# Altium project BMS_PCB.PrjPcb (part 3 of 3)

## Sheet Miccrocontroller.SchDoc
size 1244 x 774 mm; SheetNumber: 2; SheetTotal: 2
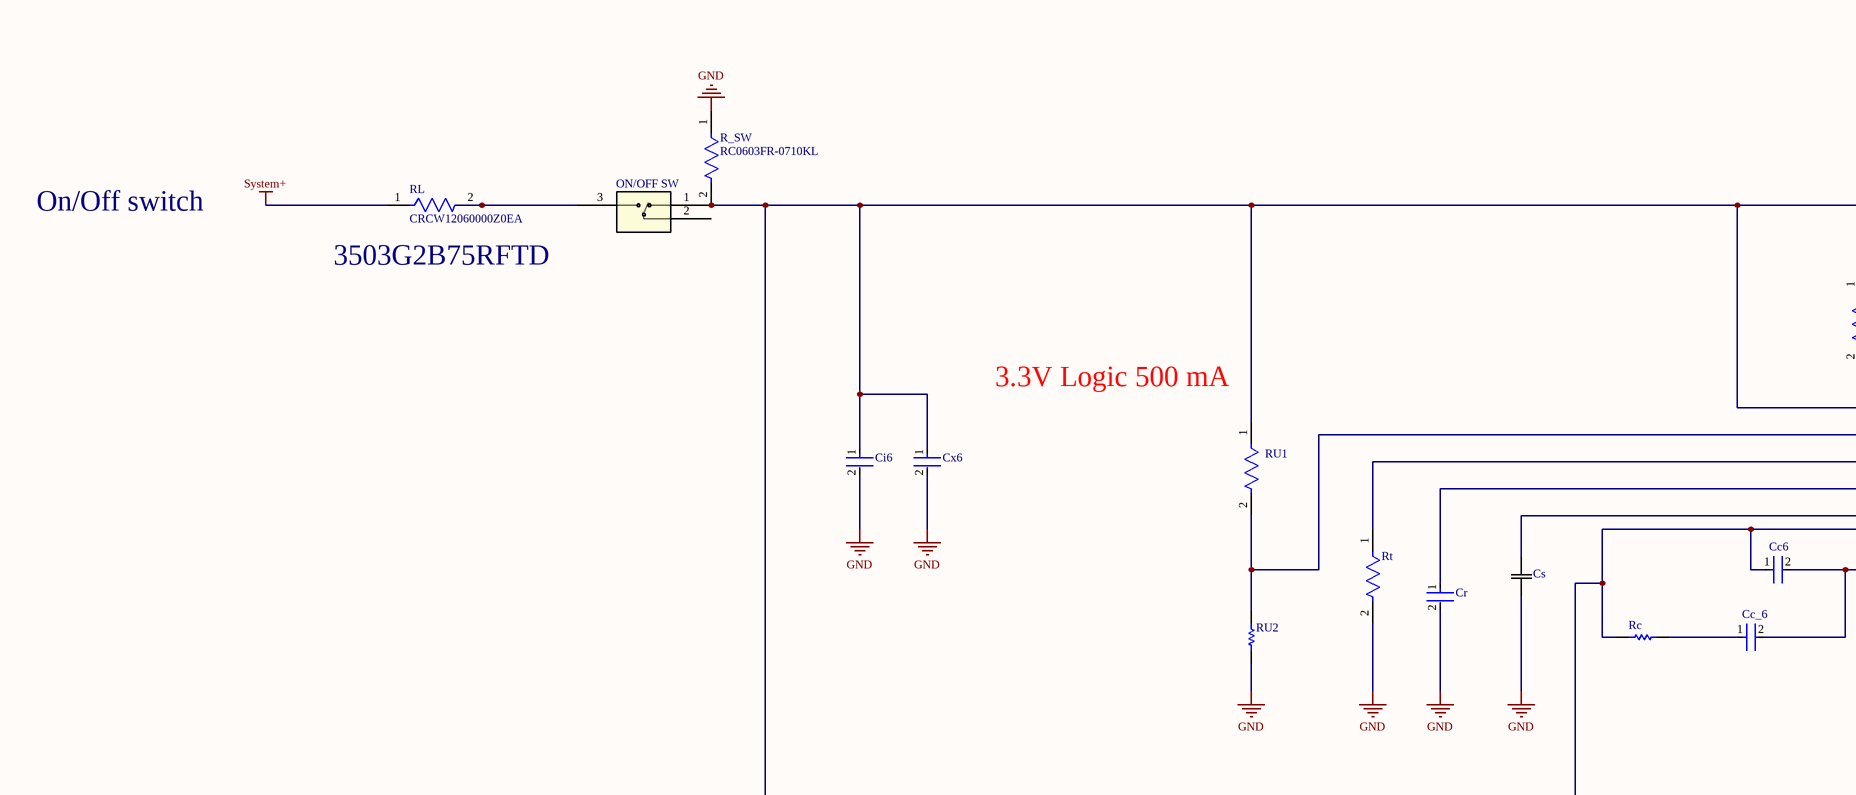
[diagram p8: Miccrocontroller.SchDoc, top left]
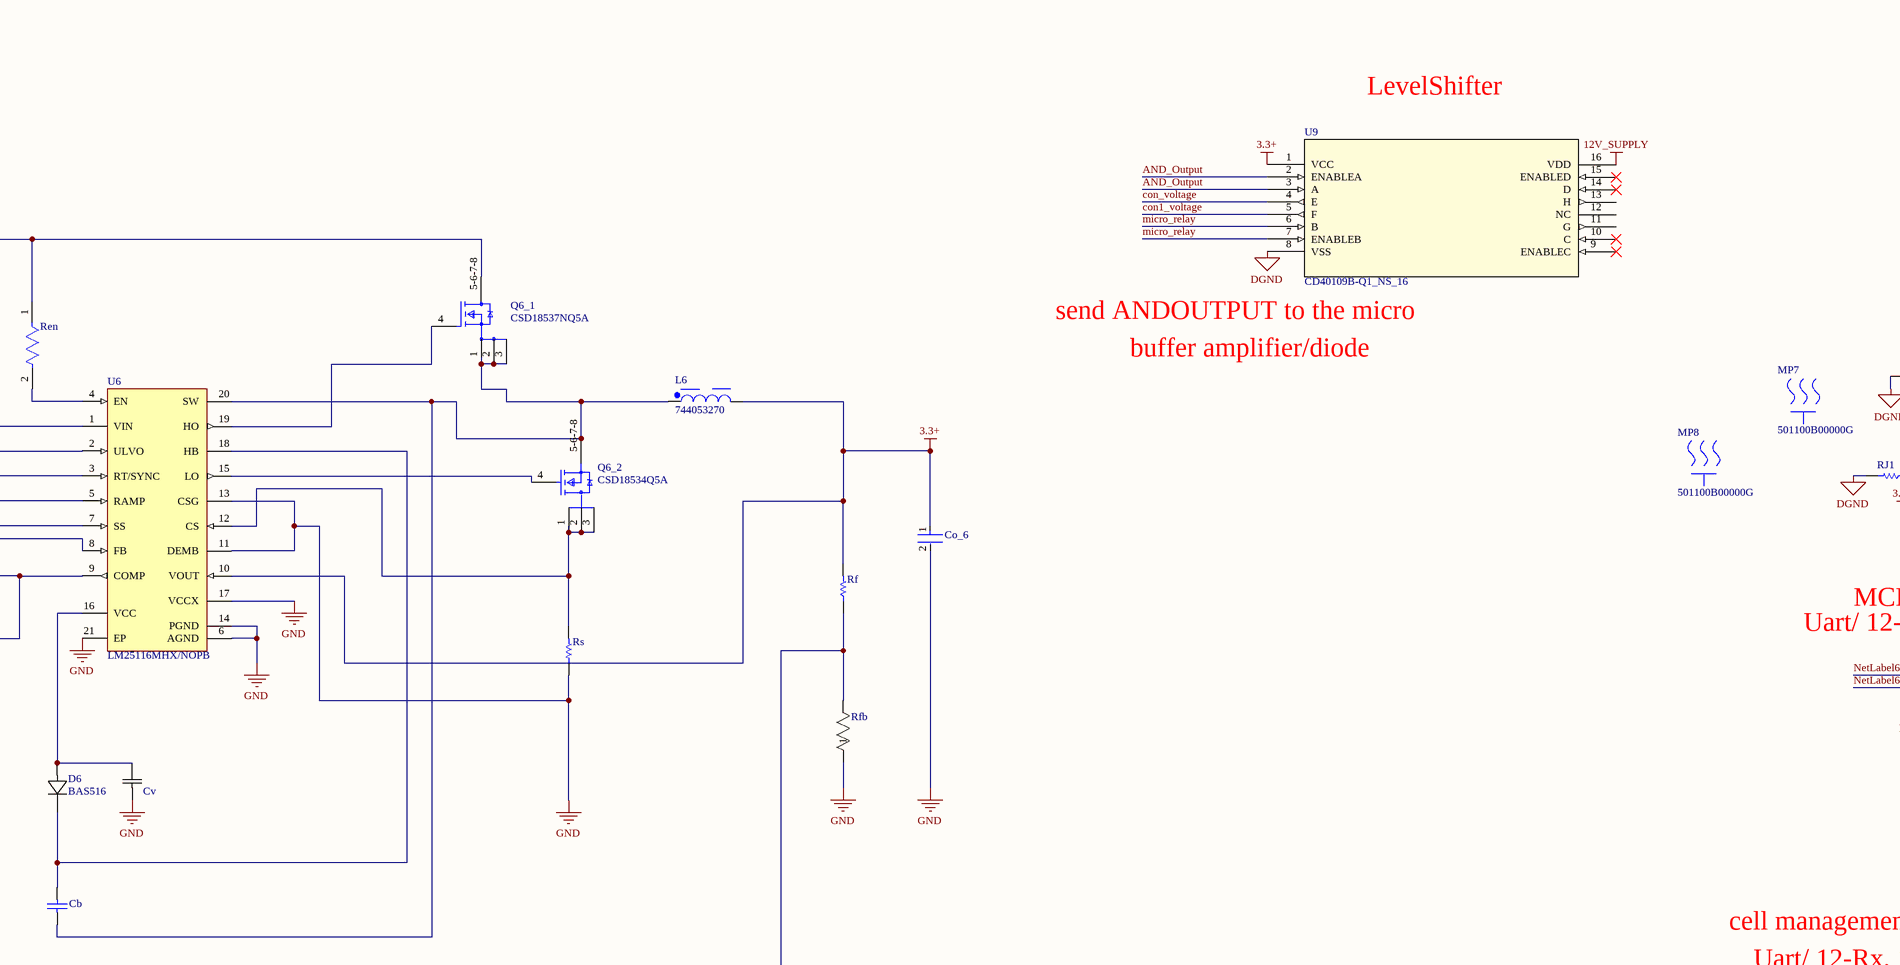
[diagram p9: Miccrocontroller.SchDoc, top middle]
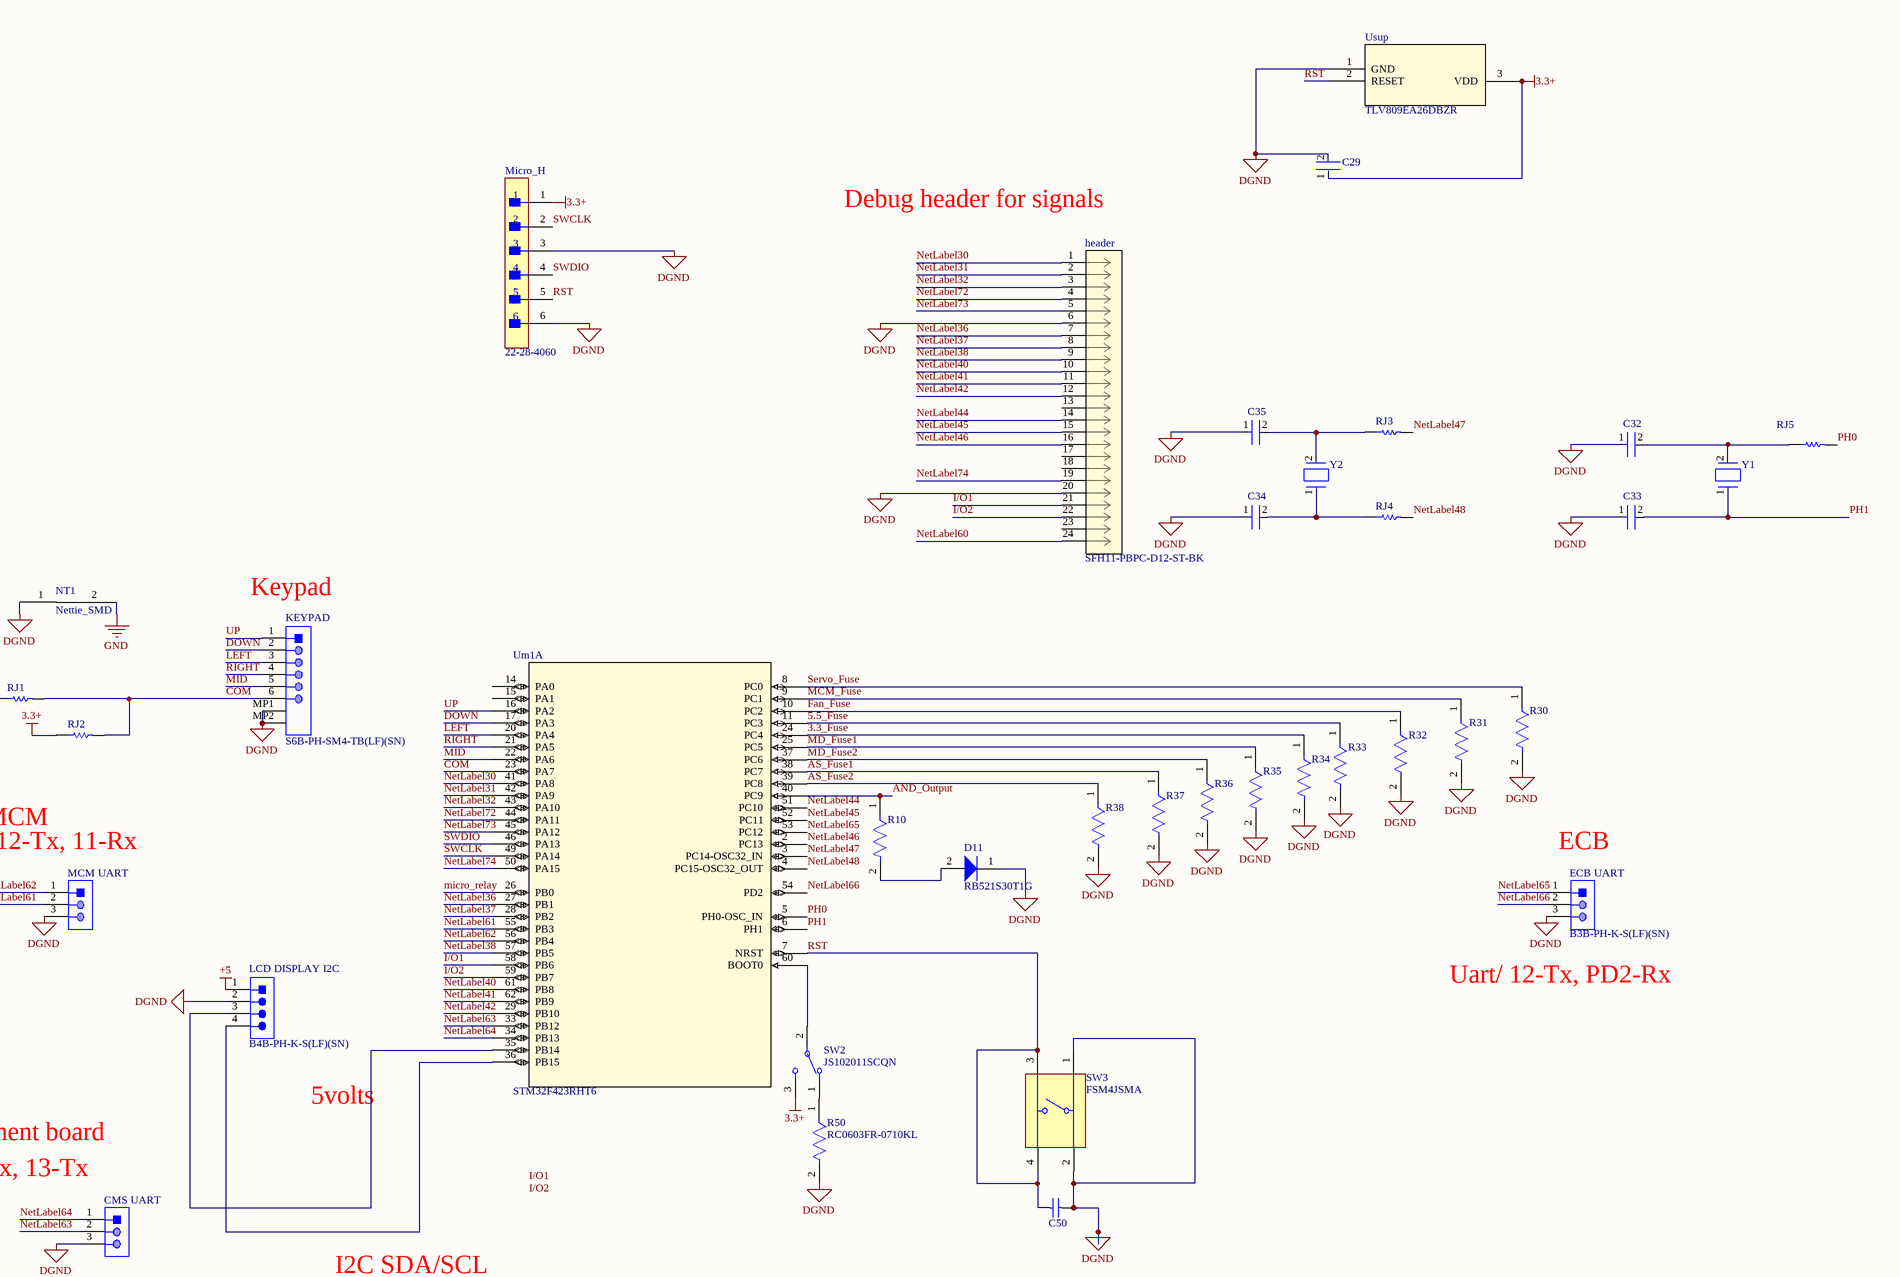
[diagram p10: Miccrocontroller.SchDoc, top right]
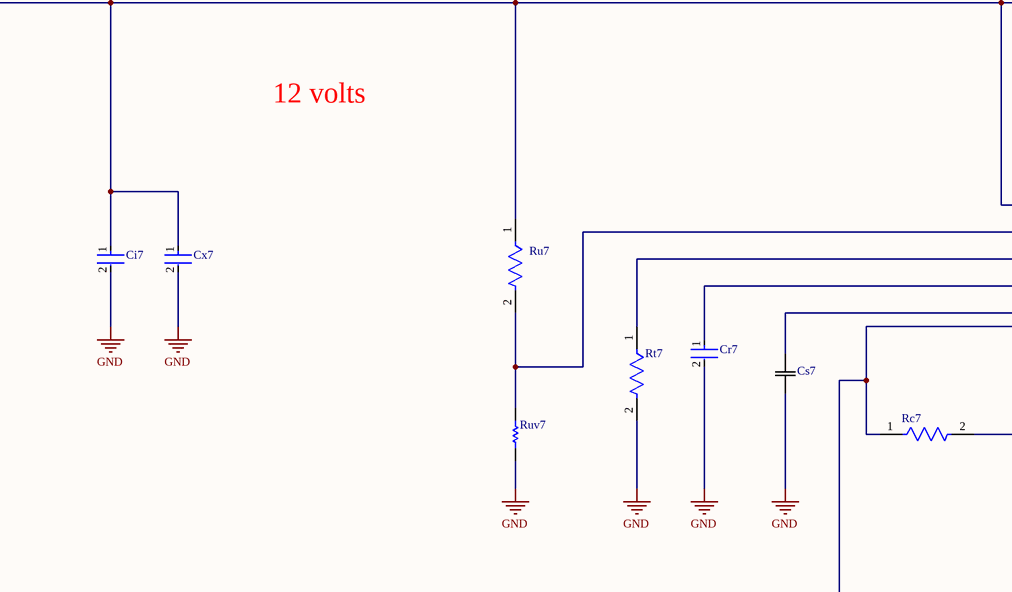
[diagram p11: Miccrocontroller.SchDoc, bottom left]
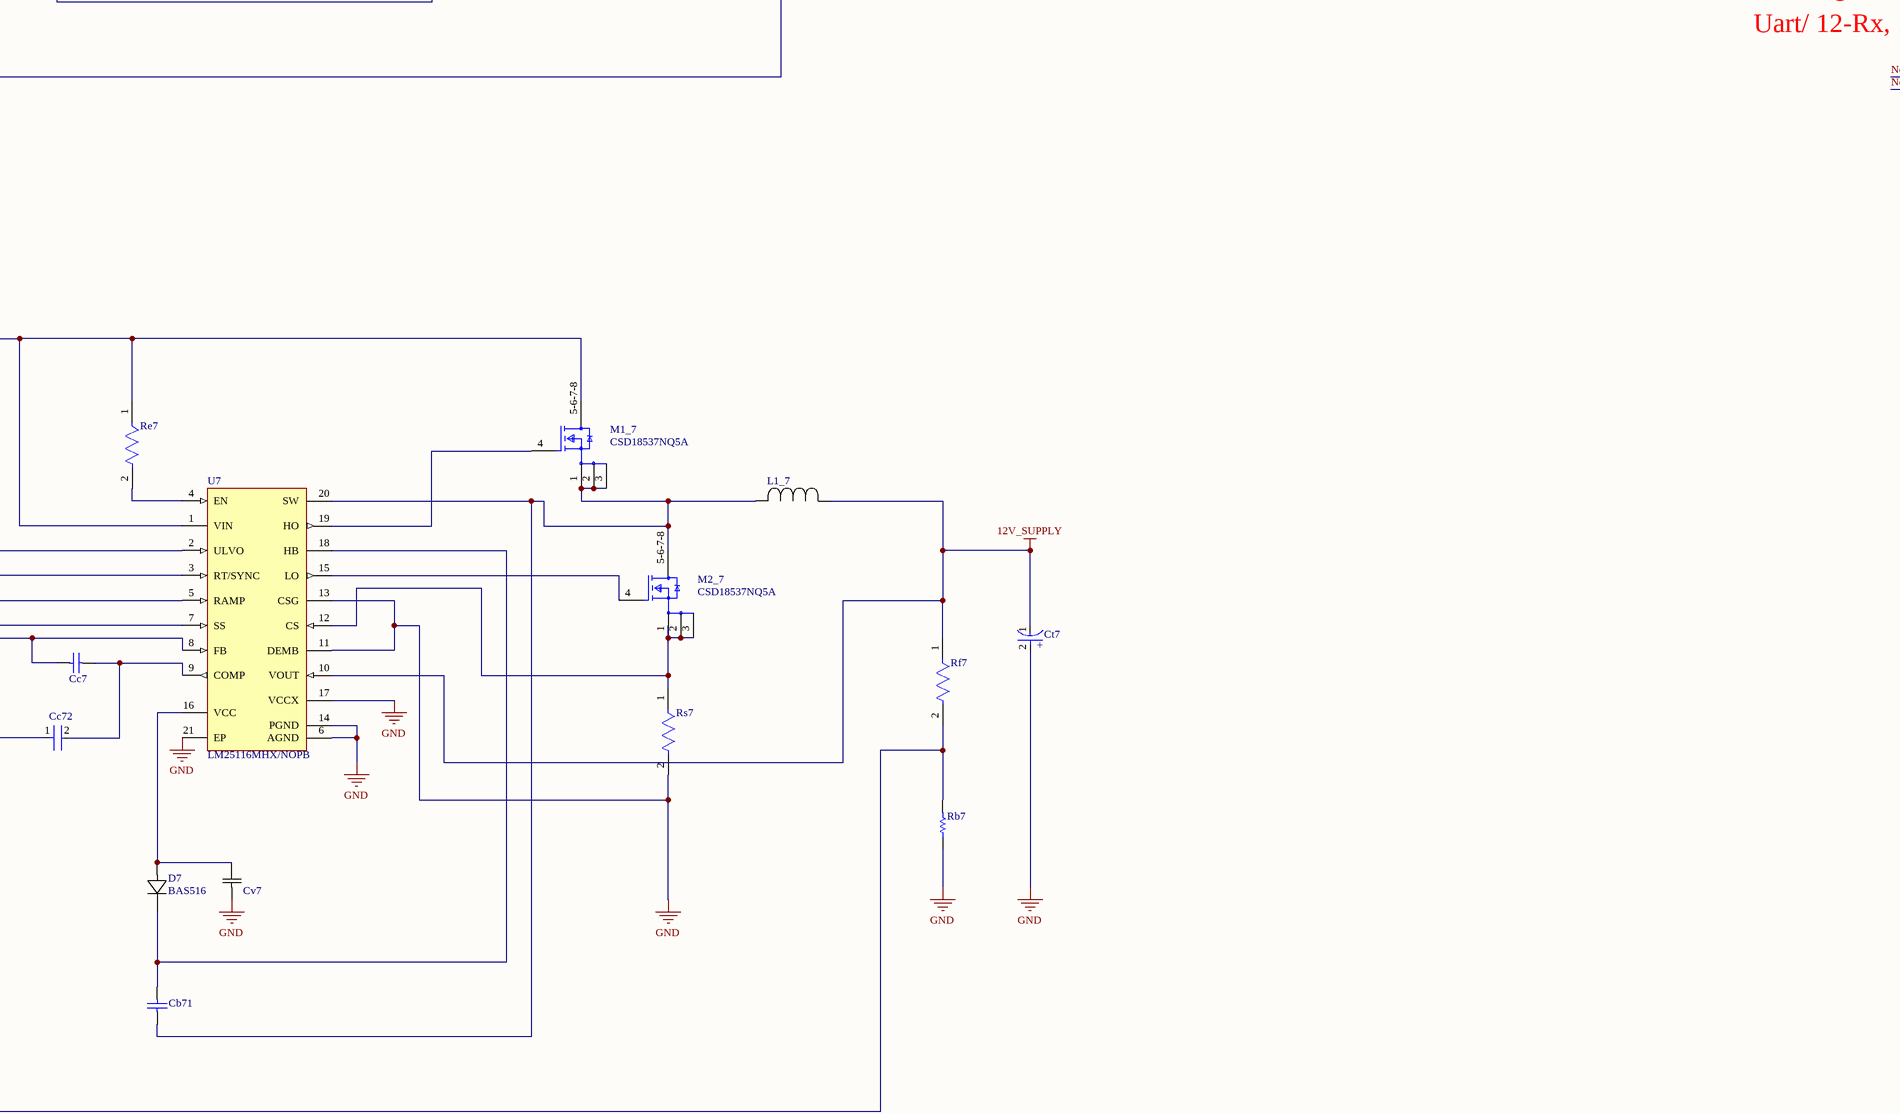
[diagram p12: Miccrocontroller.SchDoc, bottom middle]
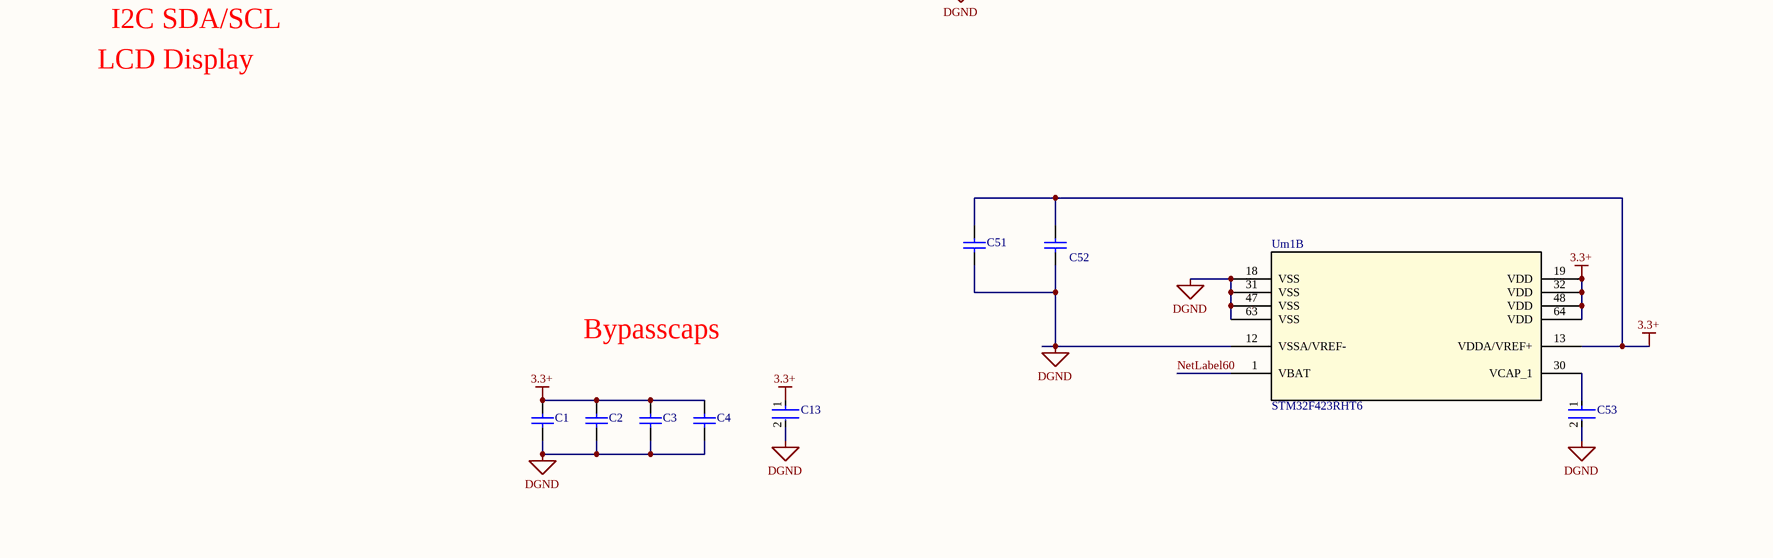
[diagram p13: Miccrocontroller.SchDoc, bottom right]

### Parts
C1  06035C104KAT4A  [CAPC1608X90X35LL15T15]  (value not drawn)
C2  06035C104KAT4A  [CAPC1608X90X35LL15T15]  (value not drawn)
C3  06035C104KAT4A  [CAPC1608X90X35LL15T15]  (value not drawn)
C4  06035C104KAT4A  [CAPC1608X90X35LL15T15]  (value not drawn)
C13  GRM188R61E475KE11D  [FP-GRM188-0_15-IPC_C]  (value not drawn)
C29  GRM155R71C104KA88D  [FP-GRM15-MFG]  (value not drawn)
C32  C0805C180J5GACTU  [FP-C0805C-DN-MFG]  (value not drawn)
C33  C0805C180J5GACTU  [FP-C0805C-DN-MFG]  (value not drawn)
C34  GJM1555C1H1R5BB01D  [FP-GJM155-0_05-IPC_C]  (value not drawn)
C35  GJM1555C1H1R5BB01D  [FP-GJM155-0_05-IPC_C]  (value not drawn)
C50  06035C104KAT4A  [CAPC1608X90X35LL15T15]  (value not drawn)
C51  C0603C105K3RACTU  [CAPC1608X87X35LL15T15]  (value not drawn)
C52  06035C104KAT4A  [CAPC1608X90X35LL15T15]  (value not drawn)
C53  GRM188R71A225KE15D  [FP-GRM188-0_1-e0_2_0_5-MFG]  (value not drawn)
Cb  08053C104K4T2A  [CAPC2013X140X50LL20T25]  (value not drawn)
Cb71  08053C104K4T2A  [CAPC2013X140X50LL20T25]  (value not drawn)
Cc6  C0805C100M4GACTU  [FP-C0805C-DN-MFG]  (value not drawn)
Cc7  GRM1555C1E5R1CA01D  [CAPC1005X55X25LL05T10]  (value not drawn)
Cc72  GRM1555C1H101FA01D  [FP-GRM155-0_05-IPC_C]  (value not drawn)
Cc_6  UMK105CG271JV-F  [FP-0402-L_1_0_0_05-W_0_5-IPC_B]  (value not drawn)
Ci6  GRM31CR71H475KA12L  [FP-GRM31C-0_2-e0_3_0_8-IPC_C]  (value not drawn)
Ci7  GRM31CR71H475KA12L  [FP-GRM31C-0_2-e0_3_0_8-IPC_C]  (value not drawn)
CMS_UART  B3B-PH-K-S(LF)(SN)  [JST-B3B-PH-K-S-3_V]  (value not drawn)
Co_6  C0805C475K8PACTU  [FP-C0805C475K8PACTU-MFG]  (value not drawn)
Cr  GRM1555C1H101FA01D  [FP-GRM155-0_05-IPC_C]  (value not drawn)
Cr7  UMK105CG271JV-F  [FP-0402-L_1_0_0_05-W_0_5-IPC_B]  (value not drawn)
Cs  CGA4J2C0G1H333J125AA  [CAP_2012_TDK-M]  (value not drawn)
Cs7  CGA4J2C0G1H333J125AA  [CAP_2012_TDK-M]  (value not drawn)
Ct7  25SVPF27MX  [FP-OS-CON-SMT-B6-MFG]  (value not drawn)
Cv  TMK212BJ105KG-T  [CAP_TMK212BJ105KG-T_TAY]  (value not drawn)
Cv7  TMK212BJ105KG-T  [CAP_TMK212BJ105KG-T_TAY]  (value not drawn)
Cx6  C0805C104M5RACTU  [FP-C0805C-DN-MFG]  (value not drawn)
Cx7  C0805C104M5RACTU  [FP-C0805C-DN-MFG]  (value not drawn)
D6  BAS516  [SOD523_NEX]
D7  BAS516  [SOD523_NEX]
D11  RB521S30T1G  [ONSC-SOD-523-2-502-01_V]
ECB_UART  B3B-PH-K-S(LF)(SN)  [JST-B3B-PH-K-S-3_V]
header  SFH11-PBPC-D12-ST-BK  [CONN_SFH11-PBPC-D12-ST-BK]
KEYPAD  S6B-PH-SM4-TB(LF)(SN)  [JST-S6B-PH-SM4-TB(LF)(SN)_V]
L1_7  MSS1038-123MLB  [IND_MSS1038_COC]  (value not drawn)
L6  744053270  [WE-TPC_5828]
LCD_DISPLAY_I2C  B4B-PH-K-S(LF)(SN)  [JST-B4B-PH-K-S_V]
M1_7  CSD18537NQ5A  [FP-DQJ0008A-MFG]
M2_7  CSD18537NQ5A  [FP-DQJ0008A-MFG]
MCM_UART  B3B-PH-K-S(LF)(SN)  [JST-B3B-PH-K-S-3_V]  (value not drawn)
Micro_H  22-28-4060  [FP-22-28-4060-MFG]
MP7  501100B00000G  [FP-501100B00000G-MFG]
MP8  501100B00000G  [FP-501100B00000G-MFG]
NT1  Nettie_SMD  [Nettie_SMD]  (net tie, no BOM)
ON/OFF_SW  100SP1T1B4M2QE  [100SP1T1_EWI]  (value not drawn)
Q6_1  CSD18537NQ5A  [FP-DQJ0008A-MFG]
Q6_2  CSD18534Q5A  [FP-DQJ0008A-MFG]
R10  RC0603FR-0710KL  [FP-RC0603-0_55-IPC_C]  (value not drawn)
R30  RC0603FR-0710KL  [FP-RC0603-0_55-IPC_C]  (value not drawn)
R31  RC0603FR-0710KL  [FP-RC0603-0_55-IPC_C]  (value not drawn)
R32  RC0603FR-0710KL  [FP-RC0603-0_55-IPC_C]  (value not drawn)
R33  RC0603FR-0710KL  [FP-RC0603-0_55-IPC_C]  (value not drawn)
R34  RC0603FR-0710KL  [FP-RC0603-0_55-IPC_C]  (value not drawn)
R35  RC0603FR-0710KL  [FP-RC0603-0_55-IPC_C]  (value not drawn)
R36  RC0603FR-0710KL  [FP-RC0603-0_55-IPC_C]  (value not drawn)
R37  RC0603FR-0710KL  [FP-RC0603-0_55-IPC_C]  (value not drawn)
R38  RC0603FR-0710KL  [FP-RC0603-0_55-IPC_C]  (value not drawn)
R50  RC0603FR-0710KL  [FP-RC0603-0_55-IPC_C]
R_SW  RC0603FR-0710KL  [FP-RC0603-0_55-IPC_C]
Rb7  ERJ-6ENF9761V  [RESC2013X70X40ML20T20]  (value not drawn)
Rc  RC0402FR-0768K1L  [RESC1005X40X25NL05T10]  (value not drawn)
Rc7  CRCW0402191KFKED  [FP-CRCW0402-e3-IPC_C]  (value not drawn)
Re7  CRCW04021M00FKED  [FP-CRCW0402-e3-MFG]  (value not drawn)
Ren  CRCW04021M00FKED  [FP-CRCW0402-e3-MFG]  (value not drawn)
Rf  ERJ-6ENF1872V  [RESC2013X70X40LL20T20]  (value not drawn)
Rf7  AC0402FR-0786K6L  [FP-AC0402-IPC_B]  (value not drawn)
Rfb  RNCF0805BTE10K4  [RES_RNCF0805_STP]  (value not drawn)
RJ1  CRCW08050000Z0EA  [RESC2013X50X30LL20T20]  (value not drawn)
RJ2  CRCW08050000Z0EA  [RESC2013X50X30LL20T20]  (value not drawn)
RJ3  CRCW08050000Z0EA  [RESC2013X50X30LL20T20]  (value not drawn)
RJ4  CRCW08050000Z0EA  [RESC2013X50X30LL20T20]  (value not drawn)
RJ5  CRCW08050000Z0EA  [RESC2013X50X30LL20T20]  (value not drawn)
RL  CRCW12060000Z0EA  [FP-CRCW1206-e3-IPC_C]
Rs  ERJ-3RSFR15V  [RESC1608X55X30ML15T15]  (value not drawn)
Rs7  CSR1206FK15L0  [FP-CSR1206-IPC_B]  (value not drawn)
Rt  CRCW04025K23FKED  [FP-CRCW0402-e3-IPC_C]  (value not drawn)
Rt7  CRCW04025K23FKED  [FP-CRCW0402-e3-IPC_C]  (value not drawn)
RU1  CRCW080541K2FKEA  [Vishay_CRCW0805-e3_MFG]  (value not drawn)
RU2  ERJ-6ENF2491V  [RESC2013X70X40LL20T20]  (value not drawn)
Ru7  CRCW080541K2FKEA  [Vishay_CRCW0805-e3_MFG]  (value not drawn)
Ruv7  ERJ-6ENF2491V  [RESC2013X70X40LL20T20]  (value not drawn)
SW2  JS102011SCQN  [FP-JS102011SCQN-MFG]
SW3  FSM4JSMA  [TECO-FSM4JSMA_V]
U6  LM25116MHX/NOPB  [PWP0020A_N]
U7  LM25116MHX/NOPB  [PWP0020A_N]
U9  CD40109B-Q1_NS_16  [NS16_TEX]
Um1  STM32F423RHT6  [LQFP64-10x10mm]  (parts A,B of 2)
Usup  TLV809EA26DBZR  [SOT_26DBZR_TEX-M]
Y1  ABM7-25.000MHZ-D2Y-T  [FP-ABM7-MFG]  (value not drawn)
Y2  MU00525-32.768K  [FP-NX3215SA-MFG]  (value not drawn)

### Nets
3.3+: C1.2 C2.2 C3.2 C4.2 C13.1 C29.1 C51.2 C52.1 Co_6.1 L6.2 Micro_H.1 Rf.2 RJ2.1 SW2.3 U6.10(VOUT) U9.1(VCC) Um1.13(VDDA/VREF+) Um1.19(VDD) Um1.32(VDD) Um1.48(VDD) Um1.64(VDD) Usup.3(VDD)
12V_SUPPLY: Ct7.1(C) L1_7.1 Rf7.1 U7.10(VOUT) U9.16(VDD)
+5: LCD_DISPLAY_I2C.1
DGND: C1.1 C2.1 C3.1 C4.1 C13.2 C29.2 C32.1 C33.1 C34.1 C35.1 C50.1 C51.1 C52.2 C53.2 CMS_UART.3 D11.1(K) ECB_UART.3 header.6 header.20 KEYPAD.MP1 KEYPAD.MP2 LCD_DISPLAY_I2C.2 MCM_UART.3 Micro_H.3 Micro_H.6 NT1.1 R30.2 R31.2 R32.2 R33.2 R34.2 R35.2 R36.2 R37.2 R38.2 R50.2 RJ1.1 SW3.1 SW3.2 U9.8(VSS) Um1.12(VSSA/VREF-) Um1.18(VSS) Um1.31(VSS) Um1.47(VSS) Um1.63(VSS) Usup.1(GND)
GND: Ci6.2 Ci7.2 Co_6.2 Cr.2 Cr7.2 Cs.1 Cs7.1 Ct7.2(A) Cv.1 Cv7.1 Cx6.2 Cx7.2 NT1.2 R_SW.1 Rb7.1 Rfb.1 Rs.1 Rs7.2 Rt.2 Rt7.2 RU2.1 Ruv7.1 U6.6(AGND) U6.11(DEMB) U6.13(CSG) U6.14(PGND) U6.17(VCCX) U6.21(EP) U7.6(AGND) U7.11(DEMB) U7.13(CSG) U7.14(PGND) U7.17(VCCX) U7.21(EP)
System+: RL.1
3.3_Fuse: R34.1 Um1.24(PC4)
5.5_Fuse: R33.1 Um1.11(PC3)
AND_Output: R10.1 U9.2(ENABLEA) U9.3(A) Um1.40(PC9)
AS_Fuse1: R37.1 Um1.38(PC7)
AS_Fuse2: R38.1 Um1.39(PC8)
COM: KEYPAD.6 RJ1.2 RJ2.2 Um1.23(PA7)
con1_voltage: U9.5(F)
con_voltage: U9.4(E)
DOWN: KEYPAD.2 Um1.17(PA3)
Fan_Fuse: R32.1 Um1.10(PC2)
I/O1: header.21 Um1.58(PB6)
I/O2: header.22 Um1.59(PB7)
LEFT: KEYPAD.3 Um1.20(PA4)
MCM_Fuse: R31.1 Um1.9(PC1)
MD_Fuse1: R35.1 Um1.25(PC5)
MD_Fuse2: R36.1 Um1.37(PC6)
micro_relay: U9.6(B) U9.7(ENABLEB) Um1.26(PB0)
MID: KEYPAD.5 Um1.22(PA6)
NetLabel30: header.1 Um1.41(PA8)
NetLabel31: header.2 Um1.42(PA9)
NetLabel32: header.3 Um1.43(PA10)
NetLabel36: header.7 Um1.27(PB1)
NetLabel37: header.8 Um1.28(PB2)
NetLabel38: header.9 Um1.57(PB5)
NetLabel40: header.10 Um1.61(PB8)
NetLabel41: header.11 Um1.62(PB9)
NetLabel42: header.12 Um1.29(PB10)
NetLabel44: header.14 Um1.51(PC10)
NetLabel45: header.15 Um1.52(PC11)
NetLabel46: header.16 Um1.2(PC13)
NetLabel47: RJ3.2 Um1.3(PC14-OSC32_IN)
NetLabel48: RJ4.2 Um1.4(PC15-OSC32_OUT)
NetLabel60: header.24 Um1.1(VBAT)
NetLabel61: MCM_UART.2 Um1.55(PB3)
NetLabel62: MCM_UART.1 Um1.56(PB4)
NetLabel63: CMS_UART.2 Um1.33(PB12)
NetLabel64: CMS_UART.1 Um1.34(PB13)
NetLabel65: ECB_UART.1 Um1.53(PC12)
NetLabel66: ECB_UART.2 Um1.54(PD2)
NetLabel72: header.4 Um1.44(PA11)
NetLabel73: header.5 Um1.45(PA12)
NetLabel74: header.19 Um1.50(PA15)
PH0: RJ5.2 Um1.5(PH0-OSC_IN)
PH1: C33.2 Um1.6(PH1) Y1.1
RIGHT: KEYPAD.4 Um1.21(PA5)
RST: C50.2 Micro_H.5 SW3.3 SW3.4 Um1.7(NRST) Usup.2(RESET)
Servo_Fuse: R30.1 Um1.8(PC0)
SWCLK: Micro_H.2 Um1.49(PA14)
SWDIO: Micro_H.4 Um1.46(PA13)
UP: KEYPAD.1 Um1.16(PA2)
NetC32_2: C32.2 RJ5.1 Y1.2
NetC34_2: C34.2 RJ4.1 Y2.1
NetC35_2: C35.2 RJ3.1 Y2.2
NetC53_1: C53.1 Um1.30(VCAP_1)
NetCb71_1: Cb71.1 L1_7.2 M1_7.1(S) M1_7.2(S) M1_7.3(S) M2_7.5-6-7-8(D) U7.20(SW)
NetCb71_2: Cb71.2 D7.1 U7.18(HB)
NetCb_1: Cb.1 L6.1 Q6_1.1(S) Q6_1.2(S) Q6_1.3(S) Q6_2.5-6-7-8(D) U6.20(SW)
NetCb_2: Cb.2 D6.1 U6.18(HB)
NetCc6_1: Cc6.1 Rc.1 Rf.1 Rfb.2 U6.8(FB)
NetCc6_2: Cc6.2 Cc_6.2 U6.9(COMP)
NetCc7_1: Cc7.1 Cc72.2 U7.9(COMP)
NetCc7_2: Cc7.2 Rb7.2 Rc7.1 Rf7.2 U7.8(FB)
NetCc72_1: Cc72.1 Rc7.2
NetCc_6_1: Cc_6.1 Rc.2
NetCi6_1: Ci6.1 Ci7.1 Cx6.1 Cx7.1 M1_7.5-6-7-8(D) ON/OFF_SW.1 Q6_1.5-6-7-8(D) R_SW.2 Re7.1 Ren.1 RU1.1 Ru7.1 U6.1(VIN) U7.1(VIN)
NetCr7_1: Cr7.1 U7.5(RAMP)
NetCr_1: Cr.1 U6.5(RAMP)
NetCs7_2: Cs7.2 U7.7(SS)
NetCs_2: Cs.2 U6.7(SS)
NetCv7_2: Cv7.2 D7.2 U7.16(VCC)
NetCv_2: Cv.2 D6.2 U6.16(VCC)
NetD11_2: D11.2(A) R10.2
NetLCD_DISPLAY_I2C_3: LCD_DISPLAY_I2C.3 Um1.35(PB14)
NetLCD_DISPLAY_I2C_4: LCD_DISPLAY_I2C.4 Um1.36(PB15)
NetM1_7_4: M1_7.4(G) U7.19(HO)
NetM2_7_1: M2_7.1(S) M2_7.2(S) M2_7.3(S) Rs7.1 U7.12(CS)
NetM2_7_4: M2_7.4(G) U7.15(LO)
NetON/OFF_SW_3: ON/OFF_SW.3 RL.2
NetQ6_1_4: Q6_1.4(G) U6.19(HO)
NetQ6_2_1: Q6_2.1(S) Q6_2.2(S) Q6_2.3(S) Rs.2 U6.12(CS)
NetQ6_2_4: Q6_2.4(G) U6.15(LO)
NetR50_1: R50.1 SW2.1
NetRe7_2: Re7.2 U7.4(EN)
NetRen_2: Ren.2 U6.4(EN)
NetRt7_1: Rt7.1 U7.3(RT/SYNC)
NetRt_1: Rt.1 U6.3(RT/SYNC)
NetRU1_2: RU1.2 RU2.2 U6.2(ULVO)
NetRu7_2: Ru7.2 Ruv7.2 U7.2(ULVO)
NetSW2_2: SW2.2(C) Um1.60(BOOT0)

Not connected (* = marked no-connect by the designer): header 13 17 18 23; ON/OFF_SW 2; U9 9(ENABLEC)* 10(C)* 11(G) 12(NC) 13(H) 14(D)* 15(ENABLED)*; Um1 14(PA0) 15(PA1)

### Notes on the sheet
- Debug header for signals
- LevelShifter
- On/Off switch
- (near RL) 3503G2B75RFTD
- (near U9) send ANDOUTPUT to the micro
- 3.3V Logic 500 mA
- buffer amplifier/diode
- (near KEYPAD) Keypad
- (near MCM_UART) Uart/ 12-Tx, 11-Rx
- MCM
- (near ECB_UART) ECB
- (near ECB_UART) Uart/ 12-Tx, PD2-Rx
- 5volts
- cell management board
- (near CMS_UART) Uart/ 12-Rx, 13-Tx
- I2C SDA/SCL
- LCD Display
- 12 volts
- Bypasscaps
- Labels drawn without touching a wire or pin: I/O1, I/O2
- (in symbol CMP-05428-001123-1) +

### Library data of the parts
C1-C4 C50 C52 = CMP-2006-04390-1: Manufacturer: AVX Interconnect / Elco; Part Number: 06035C104KAT4A
C13 = CMP-2006-02523-2: Chip Multilayer Ceramic Capacitors for General Purpose, 0603, 4.7uF, X5R, 15%, 10%, 25V; Case Code (Metric): 1608; Max Operating Temperature: 85°C; REACH SVHC: No SVHC; Voltage Rating: 25V; Dielectric: X5R; Packaging: Cut Tape; Width: 0.031inch; Min Operating Temperature: -55°C; Lead Free: Lead Free; Capacitance: 4.7uF; Height: 0.8mm; Case Code (Imperial): 0603; Length: 1.6mm; Voltage Rating (DC): 25V; Case/Package: 0603; Voltage: 25V; Tolerance: 10%; Thickness: 0.031inch; Mount: Surface Mount; Material: Ceramic; Package Quantity: 4000; Depth: 0.8mm
C29 = CMP-2100-03641-2: CAP CER 0.1UF 16V X7R 0402; Manufacturer: Murata; Standoff Height: 0mm; Tolerance: 10%; Voltage Rating: 16Vdc; Material: Ceramic; Capacitance: 0.10μF; Value: 0.10μF; RoHS: TRUE; Manufacturer Part Number: GRM155R71C104KA88D; Temperature Characteristic: X7R; Octopart: https://octopart.com/grm155r71c104ka88d-murata-196880; Digikey Description: CAP CER 0.1UF 16V X7R 0402; Device Class L3: Ceramic Capacitors; Height: 0.55mm; ComponentLink2Description: Datasheet; Temperature Range Low: -55°C; Ipc Land Pattern Name: CAPC10050X219; ComponentLink2URL: https://search.murata.co.jp/Ceramy/image/img/A01X/G101/ENG/GRM155R71H471KA01-01A.pdf; Device Class L1: Passive Components; Lead Free: yes; Category: Cap; Package: GRM15; Temperature: -55°C to +125°C; Device Class L2: Capacitors; Temperature Range High: +125°C; Mouser Description: 0402 0.1 uF 16V ±10 % Tolerance X7R SMT Multilayer Ceramic Capacitor
C32 C33 = CMP-2007-00302-2: CAP CER 18PF 50V C0G/NP0 0805; Manufacturer: KEMET; Temperature Characteristic: C0G; Tolerance: 0.05; Material: Ceramic; Temperature Coefficient: 30ppm/°C; Device Class L2: Capacitors; Capacitance: 18 pF; Temperature: -55°C to +125°C; Value: 18 pF; Package: C0805C-DN; Mouser Description: Cap Ceramic 18pF 50V C0G 5% SMD 0805 125C Paper T/R; Height: 0.88mm; ComponentLink2URL: https://content.kemet.com/datasheets/KEM_C1003_C0G_SMD.pdf; RoHS: TRUE; Octopart: https://octopart.com/c0805c180j5gactu-kemet-144810; ComponentLink2Description: Datasheet; Temperature Range High: +125°C; Digikey Description: CAP CER 18PF 50V C0G/NP0 0805; Device Class L1: Passive Components; Category: Cap; Automotive: No; Device Class L3: Ceramic Capacitors; Voltage Rating: 50 V; Temperature Range Low: -55°C; Ipc Land Pattern Name: CAPC200125X78; Lead Free: Yes; Manufacturer Part Number: C0805C180J5GACTU
C34 C35 = CMP-2008-03820-2: Multi-Layer Ceramic Capacitor 1.5pF C0G  ±0.1pF 0402 Paper T/R; Temperature Coefficient: 30ppm/°C; Voltage Rating: 50V; Depth: 0.5mm; Case Code (Imperial): 0402; Package Quantity: 10000; Length: 1mm; Number of Pins: 2; Max Operating Temperature: 125°C; Mount: Surface Mount; Construction: Flat; Thickness: 0.022inch; Series: GJM; Packaging: Tape and Reel; Radiation Hardening: No; REACH SVHC: No SVHC; Case/Package: 0402; Lead Free: Lead Free; Voltage Rating (DC): 50V; Min Operating Temperature: -55°C; Dielectric: C0G; Termination: SMD/SMT; Width: 0.5mm; Capacitance: 1.5pF; Lead Pitch: 0.3mm; Case Code (Metric): 1005; Voltage: 50V; Height: 0.5mm
C51 = CMP-2006-03713-1: Manufacturer: Kemet; Part Number: C0603C105K3RACTU
C53 = CMP-2006-02836-2: Chip Multilayer Ceramic Capacitors for General Purpose, 0603, 2.2uF, X7R, 15%, 10%, 10V; Case Code (Metric): 1608; Height: 0.8mm; Packaging: Cut Tape; Voltage: 10V; Lead Free: Lead Free; Min Operating Temperature: -55°C; Voltage Rating (DC): 10V; Max Operating Temperature: 125°C; Voltage Rating: 10V; Dielectric: X7R; Depth: 0.8mm; Case Code (Imperial): 0603; Termination: SMD/SMT; Case/Package: 0603; Number of Pins: 2; REACH SVHC: No SVHC; Mount: Surface Mount; Width: 0.031inch; Material: Ceramic; Capacitance: 2.2uF; Package Quantity: 1; Weight: 7.1E-05oz; Length: 1.6mm; Thickness: 0.035inch; Tolerance: 10%
Cb Cb71 = CMP-2007-04739-1: Manufacturer: AVX Interconnect / Elco; Part Number: 08053C104K4T2A
Cc6 = CMP-1036-00838-4: CAP CER 10PF 16V 20% NP0 0805; Manufacturer: KEMET; Tolerance: 0.2; Temperature Characteristic: C0G; Temperature Coefficient: 30ppm/°C; Height: 0.88mm; Material: Ceramic; Mouser Description: Multilayer Ceramic Capacitors MLCC - SMD/SMT 16volts 10pF C0G 20%; Device Class L2: Capacitors; Temperature Range Low: -55°C; Manufacturer Part Number: C0805C100M4GACTU; ComponentLink2URL: https://content.kemet.com/datasheets/KEM_C1003_C0G_SMD.pdf; Category: Cap; Octopart: https://octopart.com/c0805c100m4gactu-kemet-16430157; Device Class L1: Passive Components; Capacitance: 10 pF; Temperature: -55°C to +125°C; RoHS: TRUE; Package: C0805C-DN; Device Class L3: Ceramic Capacitors; Automotive: No; Value: 10 pF; Voltage Rating: 16 V; Digikey Description: CAP CER 10PF 16V 20% NP0 0805; Temperature Range High: +125°C; Ipc Land Pattern Name: CAPC200125X78; Lead Free: Yes; ComponentLink2Description: Datasheet
Cc7 = CMP-2008-04115-1: Manufacturer: Murata; Part Number: GRM1555C1E5R1CA01D
Cc72 Cr = CMP-06035-063004-1: CAP CER 100PF 50V C0G/NP0 0402; Tolerance: 1%; Temperature Coefficient: 30ppm/°C; Dielectric: C0G; Length: 1mm; Mount: Surface Mount; Package Quantity: 10000; Min Operating Temperature: -55°C; Voltage: 50V; Capacitance: 100pF; Voltage Rating: 50V; RoHS Compliant: Yes; Material: Ceramic; Width: 0.5mm; Series: GRM; Construction: Flat; Voltage Rating (DC): 50V; Height: 0.5mm; Case Code (Imperial): 0402; Case Code (Metric): 1005; Case/Package: 0402; Termination: SMD/SMT; Depth: 0.5mm; Packaging: Tape and Reel; Max Operating Temperature: 125°C; Lead Free: Lead Free; Thickness: 0.022inch
Cc_6 Cr7 = CMP-14477-003725-2: None; Capacitance: 270pF; Temperature Coefficient: 30ppm/°C; Voltage Rating: 50V; Dielectric: C0G; Tolerance: 5%; Number of Pins: 2; REACH SVHC: No SVHC; Termination: SMD/SMT; Lead Free: Lead Free; Depth: 0.5mm; Case/Package: 0402; Length: 1mm; Packaging: Tape and Reel; Radiation Hardening: No; Height: 0.5mm; Halogen Free: Halogen Free; Width: 0.02inch; Mount: Surface Mount; RoHS Compliant: Yes; Min Operating Temperature: -55°C; Package Quantity: 10000; Thickness: 0.022inch; Case Code (Imperial): 0402; Max Operating Temperature: 125°C; Case Code (Metric): 1005; Voltage Rating (DC): 50V; Series: M; Construction: Flat
Ci6 Ci7 = CMP-1037-04923-3: Chip Multilayer Ceramic Capacitors for General Purpose, 1206, 4.7uF, X7R, 15%, 10%, 50V; Height: 1.6mm; Voltage: 50V; Capacitance: 4.7uF; Lead Free: Lead Free; Max Operating Temperature: 125°C; Packaging: Tape and Reel; REACH SVHC: No SVHC; Voltage Rating: 50V; Mount: Surface Mount; Termination: SMD/SMT; Tolerance: 10%; Case/Package: 1206; Material: Ceramic; Depth: 1.6mm; Length: 3.2mm; Case Code (Metric): 3216; Voltage Rating (DC): 50V; Case Code (Imperial): 1206; Radiation Hardening: No; Width: 0.063inch; Thickness: 0.071inch; Package Quantity: 2000; Min Operating Temperature: -55°C; Dielectric: X7R
CMS_UART ECB_UART MCM_UART = CMP-2000-05164-1: Male Header, Pitch 2 mm, 1 x 3 Position, Height 6 mm, Tail Length 3.4 mm, -25 to 85 degC, RoHS, Bulk; Manufacturer: JST; Style/Orientation: StraightHeader/Plug; Pitch: 2mm; No of Positions: 3; Termination: Crimp; Manufacturer URL: http://www.jst.com/home2.html; Datasheet Version: Oct-06; Type: ShroudedHeader; Datasheet URL: https://datasheet.ciiva.com/11746/0900766b80826550-11746939.pdf
Co_6 = CMP-2007-01007-2: CAP CER 4.7UF 10V X5R 0805; Dielectric Material: Ceramic; Dissipation Factor: 5%; Tolerance: 10%; Lead Pitch: 0.75mm; Mount: Surface Mount; Voltage Rating (DC): 10V; Length: 2mm; Case Code (Imperial): 0805; Height: 1.25mm; Package Quantity: 1; Thickness: 0.055inch; Depth: 1.25mm; Case Code (Metric): 2012; Termination: SMD/SMT; Construction: Flat; Dielectric: X5R; Series: C; Capacitance: 4.7uF; Width: 1.2mm; Max Operating Temperature: 85°C; Packaging: Tape and Reel; Voltage Rating: 10V; REACH SVHC: No SVHC; Min Operating Temperature: -55°C; Number of Pins: 2; Case/Package: 0805; Radiation Hardening: No; Lead Free: Lead Free; Voltage: 10V; RoHS Compliant: Yes
Cs Cs7 = CGA4J2C0G1H333J125AA: No Description Available; Mfr_Name: TDK
Ct7 = CMP-05428-001123-1: Conductive Polymer Aluminum Solid Capacitors (OS-CON) 27uF ±20% 25V; Ripple Current (AC): 2.45A; Polarity: Polar; Dissipation Factor: 12%; ESR (Equivalent Series Resistance): 40mR; Life (Hours): 5000Hour; Leakage Current: 135uA; Diameter: 5mm; Voltage Rating (DC): 25V; Series: OS-CON™, SVPF; Height - Seated (Max): 0.236inch; Length: 5.9mm; Max Operating Temperature: 105°C; Voltage Rating: 25V; Ripple Current: 2.45A; Package Quantity: 1500; Voltage: 25V; Number of Pins: 6; Height: 5.9mm; Capacitance: 27uF; Min Operating Temperature: -55°C; RoHS Compliant: Yes; Case/Package: Radial; REACH SVHC: No SVHC; Tolerance: 20%; Packaging: Tape and Reel; Mount: Surface Mount; Termination: SMD/SMT
Cv Cv7 = TMK212BJ105KG-T: No Description Available; Mfr_Name: Taiyo Yuden
Cx6 Cx7 = CMP-1036-04423-3: CAP CER 0.1UF 50V X7R 0805; Manufacturer: KEMET; Tolerance: 0.2; Temperature Coefficient: 30ppm/°C; Capacitance: 0.10 μF; Value: 0.10 μF; Temperature: -55°C to +125°C; RoHS: TRUE; Temperature Range Low: -55°C; Device Class L3: Ceramic Capacitors; Manufacturer Part Number: C0805C104M5RACTU; Octopart: https://octopart.com/c0805c104m5ractu-kemet-129379; Ipc Land Pattern Name: CAPC200125X78; Mouser Description: Multilayer Ceramic Capacitors MLCC - SMD/SMT 50volts 0.1uF X7R 20%; Temperature Range High: +125°C; Material: Ceramic; Package: C0805C-DN; Temperature Characteristic: X7R; Automotive: No; ComponentLink2URL: https://content.kemet.com/datasheets/KEM_C1003_C0G_SMD.pdf; Device Class L1: Passive Components; ComponentLink2Description: Datasheet; Device Class L2: Capacitors; Voltage Rating: 50 V; Digikey Description: CAP CER 0.1UF 50V X7R 0805; Lead Free: Yes; Height: 0.88mm; Category: Cap
D6 D7 = BAS516: No Description Available; Mfr_Name: Nexperia
D11 = CMP-1051-00018-1: Schottky Barrier Diode, 2-Pin SOD-523, Pb-Free, Tape and Reel; Manufacturer: On Semiconductor; Configuration: Single; IFSM Max (A): 1; Mounting Technology: Surface Mount; ComponentLink1Description: Manufacturer URL; PackageReference: SOD-523-2-502-01; RoHS: TRUE; ComponentLink3Description: Package Specification; ComponentLink2Description: Datasheet; PackageVersion: Rev. E, 09/2010; PartNumber: RB521S30T1G; ComponentLink3URL: http://www.onsemi.com/pub_link/Collateral/502-01.PDF; ComponentLink1URL: http://www.onsemi.com/; PackageDescription: 2-Pin SOD, Body 1.2 x 0.8 mm; DatasheetVersion: Rev. 8; ComponentLink2URL: http://www.onsemi.cn/pub_link/Collateral/RB521S30T1-D.PDF; Packing: Tape and Reel
header = SFH11-PBPC-D12-ST-BK: No Description Available; Mfr_Name: Sullins; RefDes: RefDes; Type: Type
KEYPAD = CMP-2000-07027-1: Male Header, Pitch 2 mm, 1 x 6 Position, Height 5.5 mm, -25 to 85 degC; Manufacturer: JST; Pitch: 2mm; Style/Orientation: RightAngleHeader/Plug; No of Positions: 6; Package Reference: S6B-PH-SM4-TB(LF)(SN); Type: ShroudedHeader; Package Description: Male Header, Pitch 2 mm, 1 x 6 Position, Height 5.5 mm; Mounting Technology: SurfaceMount; Datasheet Version: 11/2008; Termination: Solder; Datasheet URL: https://datasheet.ciiva.com/11747/0900766b80df0d9d-11747278.pdf; Manufacturer URL: http://www.jst.com/home2.html
L1_7 = MSS1038-123MLB: No Description Available; Mfr_Name: Coilcraft
L6 = CMP-0227-00379-3: NexarPartId: 22803252; Inductance Tolerance: 30%; Self Resonant Frequency: 15MHz; Inductance: 27µH; DC Resistance (DCR): 135mΩ; Current Rating: 1.05A; Length: 5.8mm; Ambient Temperature Range High: 95°C; Height: 2.8mm; Number of Pins: 2; Ambient Temperature Range Low: -40°C; Max Operating Temperature: 125°C; Packaging: Cut Tape (CT); Width: 5.8mm; Min Operating Temperature: -40°C; RoHS: Compliant
LCD_DISPLAY_I2C = CMP-2000-05165-1: Male Header, Pitch 2 mm, 1 x 4 Position, Height 6 mm, Tail Length 3.4 mm, -25 to 85 degC, RoHS, Bulk; Manufacturer: JST; No of Positions: 4; Style/Orientation: StraightHeader/Plug; Pitch: 2mm; Datasheet URL: http://datasheet.octopart.com/B4B-PH-K-S%28LF%29%28SN%29-JST-datasheet-10558886.pdf; Type: ShroudedHeader; Manufacturer URL: http://www.jst.com/home2.html; Termination: Crimp; Datasheet Version: Apr-09
M1_7 M2_7 Q6_1 = CMP-04962-000050-1: MOSFET N-CH 60V 50A 8SON; Power Dissipation: 3.2W; Nominal Vgs: 3V; Turn-On Delay Time: 5.8ns; Turn-Off Delay Time: 14.4ns; Rise Time: 4ns; Drain to Source Resistance: 13mR; Input Capacitance: 1.48nF; Continuous Drain Current (ID): 62A; Fall Time: 3.2ns; Number of Elements: 1; Element Configuration: Single; Gate to Source Voltage (Vgs): 20V; Lead Free: Contains Lead; Max Power Dissipation: 3.2W; Max Operating Temperature: 150°C; Contact Plating: Copper; Mount: Surface Mount; Drain to Source Voltage (Vdss): 60V; REACH SVHC: No SVHC; Radiation Hardening: No; Packaging: Tape and Reel; Package Quantity: 2500; Rds On Max: 13mR; Drain to Source Breakdown Voltage: 60V; Number of Pins: 8; RoHS Compliant: Yes; Min Operating Temperature: -55°C
Micro_H = CMP-04776-000763-1: CONN HEADER VERT 6POS 2.54MM; Voltage Rating: 250V; Current Rating: 4A; Number of Contacts: 6; Max Voltage Rating (DC): 250.25kV; Gender: Male; Contact Resistance: 20mR; Connector Type: Male Pin; Color: Black; Max Voltage Rating (AC): 250V; Pitch: 2.54mm; Orientation: Straight; Max Operating Temperature: 75°C; Contact Plating: Tin; Depth: 2.49mm; Contact Type: Male Pin; Number of Positions: 6; Length: 15.24mm; Packaging: Bulk; Mount: Through Hole; Housing Material: Thermoplastic; Housing Color: Black; Termination: Solder; Contact Material: Brass; Min Operating Temperature: 0°C; Series: KK® 42375; Number of Rows: 1; Package Quantity: 1; RoHS Compliant: Yes; Contact Mating Length: 0.24inch
MP7 MP8 = CMP-69313-000006-1: HEATSINK 14-DIP/16-DIP; Thermal Resistance @ Forced Air Flow (100 LFM): 30°C/W; Shape: Fins; Natural Thermal Resistance: 67°C/W; Finish: Anodized; Depth: 19.05mm; Length: 0.75inch; Material: Aluminium; Width: 0.25inch; RoHS Compliant: Yes; Type: Passive; Height Off Base: 0.19inch; Mount: Adhesive; Color: Black; Height: 4.826mm; Package Quantity: 2000; REACH SVHC: No SVHC; Lead Free: Lead Free; Number of Pins: 14; Packaging: Bulk
ON/OFF_SW = 100SP1T1B4M2QE: No Description Available; Mfr_Name: E-Switch; Type: Toggle Switches; RefDes: RefDes
Q6_2 = CMP-04962-000014-1: MOSFET N-CH 60V 8SON; Manufacturer: Texas Instruments; Reverse Recovery Time: 40ns; Input Capacitace At Vds: 1360pF @ 30V; Transconductance: 72S; Gate Charge At Vgs: 17nC @ 10V; Threshold Vgs Max: 2.3V; Threshold Vgs Min: 1.5V; Number Of Channels: 1; Rthja Max: 50°C/W; Continuous Drain Current: 13A; Typ Forward Diode Voltage: 0.8V; Max Forward Diode Voltage: 1V; Gate To Source Voltage: 20V; Depletion Mode: False; Turn Off Delay Time: 15ns; Drain To Source Resistance: 7.8mΩ; Max Junction Temp: +150°C; Pulse Drain Current: 229A; Power Dissipation: 3.1W; Turn On Delay Time: 5.2ns; Reverse Recovery Charge: 54nC; Digikey Description: MOSFET N-CH 60V 8SON; ComponentLink2URL: http://www.ti.com/lit/ds/symlink/csd18534q5a.pdf; Temperature Range High: +150°C; Drain To Source Voltage: 60V; Automotive: No; RoHS: TRUE; Mouser Description: MOSFET 60V N-Ch NexFET Pwr MOSFET; Temperature Range Low: -55°C; Manufacturer Part Number: CSD18534Q5A; Octopart: https://octopart.com/csd18534q5a-texas+instruments-22791040; Device Class L1: Discrete Semiconductors; Device Class L2: Transistors; ComponentLink2Description: Datasheet; Number Of N Channels: 1; Height: 1.1mm; Device Class L3: MOSFETs; Temperature: -55°C to +150°C; Lead Free: Yes; Drain To Source Breakdown Voltage: 60V; Package: DQJ0008A; Category: Trans
R10 R30-R38 R50 R_SW = CMP-2100-03664-2: RES 10K OHM 1% 1/10W 0603; Voltage Rating: 75V; Voltage Rating (DC): 50V; Resistance: 10kR; Power Rating: 100mW; Temperature Coefficient: 100ppm/°C; Depth: 0.8mm; Termination: SMD/SMT; Resistor Type: Thick Film; Series: RC; Construction: Rectangular; Features: Moisture Resistant; Packaging: Tape and Reel; Min Operating Temperature: -55°C; Number of Terminations: 2; Lead Pitch: 0.3mm; RoHS Compliant: Yes; Case/Package: 0603; Resistance Tolerance: 1%; Military Standard: Not; Weight: 7.1E-05oz; Number of Pins: 2; Tolerance: 1%; Length: 1.6mm; Case Code (Imperial): 0603; Lead Free: Lead Free; Width: 0.8mm; Max Power Dissipation: 100mW; Height: 0.45mm; Max Operating Temperature: 155°C; Case Code (Metric): 1608; Size Code: 0603
Rb7 = CMP-1013-00622-2: Manufacturer: Panasonic; Part Number: ERJ-6ENF9761V
Rc = CMP-2002-07773-1: Manufacturer: Yageo / Phycomp; Part Number: RC0402FR-0768K1L
Rc7 = CMP-2002-08268-4: RES Thick Film, 191kΩ, 1%, 0.063W, 100ppm/°C, 0402; Voltage Rating (DC): 50V; Power Rating: 63mW; Resistance: 191kR; Composition: Thick Film; Radiation Hardening: No; Contact Plating: Tin; Temperature Coefficient: 100ppm/°C; Max Operating Temperature: 155°C; Features: Automotive AEC-Q200; Min Operating Temperature: -55°C; Case/Package: 0402; Tolerance: 1%; Weight: 2.3E-05oz; Height: 0.016inch; Package Quantity: 10; Case Code (Metric): 1005; Termination: SMD/SMT; Depth: 0.5mm; Max Power Dissipation: 63mW; Voltage Rating: 50V; Packaging: Tape and Reel; Length: 1mm; Case Code (Imperial): 0402; Width: 0.5mm; Lead Free: Lead Free; Number of Pins: 2; Number of Terminations: 2; Military Standard: Not
Re7 Ren = CMP-2002-08314-2: RES Thick Film, 1MΩ, 1%, 0.063W, 100ppm/°C, 0402; Power Rating: 63mW; Voltage Rating (DC): 50V; Resistance: 1MR; Min Operating Temperature: -55°C; Lead Free: Lead Free; Case Code (Imperial): 0402; Packaging: Tape and Reel; Case Code (Metric): 1005; Tolerance: 1%; Number of Terminations: 2; Features: Automotive AEC-Q200; Number of Pins: 2; Max Power Dissipation: 63mW; Height: 0.35mm; Weight: 2.3E-05oz; Package Quantity: 10; Contact Plating: Tin; Temperature Coefficient: 100ppm/°C; Radiation Hardening: No; Length: 1mm; Termination: SMD/SMT; Depth: 0.5mm; Case/Package: 0402; Voltage Rating: 50V; Composition: Thick Film; Width: 0.02inch; Max Operating Temperature: 155°C; Military Standard: Not
Rf = CMP-2001-00015-1: Manufacturer: Panasonic; Part Number: ERJ-6ENF1872V
Rf7 = CMP-03412-015018-2: RES 86.6kΩ ±1% 0.063W 0402; Resistance: 86.6kR; Voltage Rating: 50V; Power Rating: 62.5mW; Max Power Dissipation: 63mW; Temperature Coefficient: 100ppm/°C; Min Operating Temperature: -55°C; Weight: 2.3E-05oz; Case/Package: 0402; Max Operating Temperature: 155°C; Features: Moisture Resistant; RoHS Compliant: Yes; Number of Terminations: 2; Resistor Type: Thick Film; Case Code (Metric): 1005; Case Code (Imperial): 0402; Width: 0.5mm; Packaging: Tape and Reel; Length: 0.039inch; Height: 0.015inch; Tolerance: 1%; Series: AC; Termination: SMD/SMT
Rfb = RNCF0805BTE10K4: No Description Available; Mfr_Name: Stackpole International
RJ1-RJ5 = CMP-2001-04896-1: Manufacturer: Vishay Dale; Part Number: CRCW08050000Z0EA
RL = CMP-2003-04857-2: RES Thick Film, 0Ω, 0.25W, 1206; Resistance: 0mR; Power Rating: 250mW; Temperature Coefficient: 100ppm/°C; Tolerance: 1%; Voltage Rating (DC): 200V; Width: 1.6mm; Termination: SMD/SMT; Contact Plating: Tin; Min Operating Temperature: -55°C; Military Standard: Not; Mount: Surface Mount; Case Code (Metric): 3216; Case Code (Imperial): 1206; Packaging: Tape and Reel; Depth: 1.6mm; Case/Package: 1206; Radiation Hardening: No; Height: 0.55mm; Package Quantity: 5000; Weight: 0.000353oz; Max Operating Temperature: 155°C; Length: 3.2mm; Composition: Thick Film; Lead Free: Lead Free; Voltage Rating: 200V
Rs = CMP-2000-00864-1: Manufacturer: Panasonic; Part Number: ERJ-3RSFR15V
Rs7 = CMP-26527-006578-1: General Purpose Thick Film Chip Resistor, 1206, 15mΩ, 1%, 0.5W; Temperature Coefficient: 100ppm/°C; Max Power Dissipation: 500mW; Resistance: 15mR; Length: 0.12inch; Mount: Surface Mount; Resistor Type: Thick Film; Number of Terminations: 2; Contact Plating: Tin; Max Operating Temperature: 155°C; Height: 0.026inch; Radiation Hardening: No; Case Code (Imperial): 1206; Width: 0.061inch; Tolerance: 1%; Series: CSR; RoHS Compliant: Yes; Case/Package: 1206; Min Operating Temperature: -55°C; Case Code (Metric): 3216; Packaging: Tape and Reel; Lead Free: Lead Free
Rt Rt7 = CMP-2002-00118-4: RES Thick Film, 5.23kΩ, 1%, 0.063W, 100ppm/°C, 0402; Max Power Dissipation: 63mW; Resistance: 5.23kR; Working Voltage: 50V; Case Code (Metric): 1005; Military Standard: Not; Lead Free: Lead Free; Height: 0.35mm; Min Operating Temperature: -55°C; Contact Plating: Tin; Length: 1mm; Max Operating Temperature: 155°C; Number of Terminations: 2; Power Rating: 63mW; Packaging: Tape and Reel; Termination: SMD/SMT; Temperature Coefficient: 100ppm/°C; Weight: 2.3E-05oz; Composition: Thick Film; Case Code (Imperial): 0402; Number of Pins: 2; Width: 0.5mm; Depth: 0.5mm; Radiation Hardening: No; Voltage Rating: 50V; Case/Package: 0402; Features: Automotive AEC-Q200; Tolerance: 1%; Voltage Rating (DC): 50V; Package Quantity: 10
RU1 Ru7 = CMP-2001-03906-2: NexarPartId: 39846735; Manufacturer Package Identifier: CRCW0805-e3; Power Rating: 125mW; Voltage Rating: 150V; Temperature Coefficient: 100ppm/°C; Tolerance: 1%; Resistance: 41.2kΩ; Schedule B: 8533210045, 8533210045; Lead Free: Lead Free; Case Code (Imperial): 0805; Max Operating Temperature: 155°C; Features: Automotive AEC-Q200; Military Standard: Not; Depth: 1.25mm; Voltage Rating (DC): 150V; Composition: Thick Film; Contact Plating: Tin; Min Operating Temperature: -55°C; Weight: 5.499807mg; RoHS: Compliant; REACH SVHC: Unknown; Case Code (Metric): 2012; Width: 1.2446mm; Length: 2mm; Case/Package: 0805; Number of Pins: 2; Number of Terminations: 2; Height: 500µm; Radiation Hardening: No; Packaging: Cut Tape; Max Power Dissipation: 125mW; Termination: SMD/SMT
RU2 Ruv7 = CMP-2001-00072-1: Manufacturer: Panasonic; Part Number: ERJ-6ENF2491V
SW2 = CMP-10038-000023-1: SWITCH SLIDE SPDT 300MA 6V; Electrical Life: 5000Cycles; Actuator Type: Standard; Contact Resistance: 70mR; Actuator Material: Nylon; Max Voltage Rating (DC): 30V; Actuator Length: 2mm; Switch Function: On-On; Actuator Color: Black; Radiation Hardening: No; Throw Configuration: SPDT; Depth: 7.5mm; Case/Package: SMD/SMT; Package Quantity: 4000; Min Operating Temperature: -40°C; Length: 8.5mm; Current Rating: 300mA; Mount: Surface Mount; Voltage Rating (DC): 6V; RoHS Compliant: Yes; Orientation: Straight; Housing Material: Nylon; Contact Plating: Silver; Max Operating Temperature: 85°C; Packaging: Tape and Reel; Switch Travel: 2mm; Max Current Rating: 300mA; Contact Material: Copper Alloy; Series: JS; Termination: Gull Wing
SW3 = CMP-2000-05602-2: Swicth, SPST, 24 V, -35 to 85 degC, 4-Pin SMD, RoHS, Tape and Reel; Manufacturer: TE Connectivity; Switch Travel: 0.25mm; Mechanical Life: 100000Cycles; Contact Current Rating: 50mA; Operating Force: 1.57N; Actuator Material: Polyamide; Contact Resistance: 100mOhm; Voltage Rating: 24V; Illumination Type: Illuminated; Actuator Length: 0.055inch; Max Voltage Rating (DC): 12V; Case\/Package: SMD/SMT; Orientation: Straight; Datasheet URL: http://www.te.com/commerce/DocumentDelivery/DDEController?Action=showdoc&DocId=Customer+Drawing%7F2-1437565-7%7FV%7Fpdf%7FEnglish%7FENG_CD_2-1437565-7_V.pdf%7F4-1437565-2; Min Operating Temperature: -35degC; Packaging: LoosePiece; Termination: GullWing; Throw Configuration: SPST; Package Description: 4-Pin Surface Mount Device, Body 6 x 6 mm, Pitch 4.5 mm; Mounting Technology: SurfaceMount; Contact Plating: Silver; Datasheet Version: Rev. V, 02/2015; RoHSCompliant: true; Max Operating Temperature: 85degC; Length: 6mm; Voltage Rating (DC): 24V; Electrical Life: 100000Cycles; Current Rating: 50mA; Package Quantity: 750; Mount: SurfaceMount; Package Reference: FSM4JSMA; Manufacturer URL: http://www.te.com/; Width: 6mm; REACH SVHC: Unknown; Contact Material: CopperAlloy
U6 U7 = CMP-0069-01417-3: Wide Range Synchronous Buck Controller, 20-pin TSSOP-EP, Pb-Free; Manufacturer: Texas Instruments; CompType: Switcher; PowerWise: Y; PackageTopMarking: NSUZXYTT*LM25116*MH; PackageDescription: Molded TSSOP, Jedec, 6.5 x 4.4 x 0.9mm Body, 20 Lead, 0.65mm Pitch, Exposed Pad; PinCount: 20; Code_JEDEC: MO-153-ACT; ComponentLink1URL: http://www.ti.com/general/docs/lit/getliterature.tsp?genericPartNumber=LM25116&fileType=pdf; RoHS: Y; ComponentLink1Description: Datasheet URL; PackageReference: PWP0020A
U9 = CD40109B-Q1_NS_16: No Description Available; Mfr_Name: Texas Instruments; RefDes: RefDes; Type: Type
Um1 = STM32F423RHT6: No Description Available; Mfr_Name: STMicroelectronics; RefDes: RefDes; Type: Type
Usup = TLV809EA26DBZR: No Description Available; Mfr_Name: Texas Instruments; RefDes: RefDes; Type: Type
Y1 = CMP-27762-010820-1: Crystal 25MHz ±20ppm 18pF SMD-2 6mm x 3.5mm; Frequency Stability: 30ppm; ESR (Equivalent Series Resistance): 50R; Depth: 3.5mm; Mount: Surface Mount; Termination: SMD/SMT; Packaging: Tape and Reel; Tolerance: 20ppm; REACH SVHC: Yes; Package Quantity: 1000; Resistor Type: Ceramic; Min Operating Temperature: -40°C; Frequency: 25MHz; Load Capacitance: 18pF; Number of Pins: 2; Case/Package: CSMD; Series: ABM7; Lead Free: Lead Free; Max Operating Temperature: 85°C; Radiation Hardening: No; Frequency Tolerance: 20ppm; Height: 0.055inch; Series Resistance: 50R; Length: 6mm; Width: 3.3mm; Operating Frequency: 25 MHz
Y2 = CMP-00536-143767433-1: MU00525-32.768K Crystal 32.7680KHZ 6PF SMD; NexarPartId: 143767433

## Nets that join several sheets
3.3+: BuckConverters (37 pins), Miccrocontroller (22 pins)
+5: BuckConverters (5 pins), Miccrocontroller (LCD_DISPLAY_I2C.1)
DGND: BuckConverters (RF_LINK.2 UA.3), Miccrocontroller (46 pins)
GND: BuckConverters (171 pins), Miccrocontroller (34 pins)
System+: BuckConverters (CR15.1 K1.1 K2.1 MP+.1), Miccrocontroller (RL.1)
3.3_Fuse: BuckConverters (U3.3.1 U3.3.4 U3.3_2.3), Miccrocontroller (R34.1 Um1.24)
5.5_Fuse: BuckConverters (U2_5.5.3 U5.5.1 U5.5.4), Miccrocontroller (R33.1 Um1.11)
AND_Output: BuckConverters (UA.4), Miccrocontroller (R10.1 U9.2 U9.3 Um1.40)
AS_Fuse1: BuckConverters (U2AS.3 UAS_1.1 UAS_1.4), Miccrocontroller (R37.1 Um1.38)
AS_Fuse2: BuckConverters (U3AS.3 UAS_2.1 UAS_2.4), Miccrocontroller (R38.1 Um1.39)
con1_voltage: BuckConverters (JR.1 K1.5), Miccrocontroller (U9.5)
con_voltage: BuckConverters (K2.5), Miccrocontroller (U9.4)
Fan_Fuse: BuckConverters (U2_fans.3 Ufans.1 Ufans.4), Miccrocontroller (R32.1 Um1.10)
MCM_Fuse: BuckConverters (U2_mcm.3 Umcm.1 Umcm.4), Miccrocontroller (R31.1 Um1.9)
MD_Fuse1: BuckConverters (U2_MD.3 UMD_1.1 UMD_1.4), Miccrocontroller (R35.1 Um1.25)
MD_Fuse2: BuckConverters (U3_MD.3 UMD_2.1 UMD_2.4), Miccrocontroller (R36.1 Um1.37)
micro_relay: BuckConverters (UA.1), Miccrocontroller (U9.6 U9.7 Um1.26)
Servo_Fuse: BuckConverters (U2_servo.3 Uservo.1 Uservo.4), Miccrocontroller (R30.1 Um1.8)